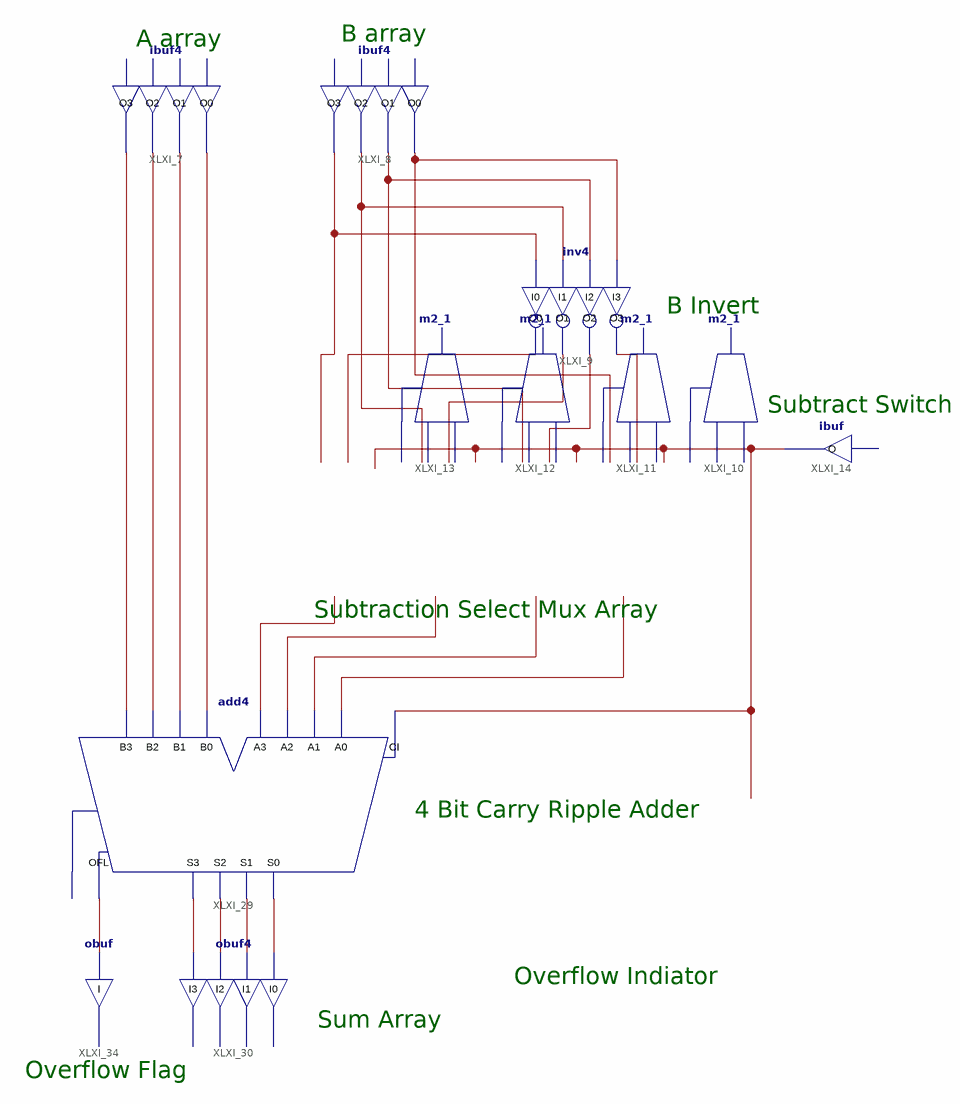
[diagram p0: schematic sheet 1]
// Xilinx ISE schematic Adder_Module_Schematic.sch (spartan3e) as structural Verilog: 11 symbols, 0 ports
module Adder_Module_Schematic (
);

  wire XLXN_8, XLXN_10, XLXN_11, XLXN_14, XLXN_17, XLXN_19, XLXN_20, XLXN_21, XLXN_22, XLXN_23, XLXN_24,
       XLXN_25, XLXN_26, XLXN_29, XLXN_30, XLXN_32, XLXN_34, XLXN_35, XLXN_36, XLXN_37, XLXN_38, XLXN_45;

  ibuf4 XLXI_8 (.O0(XLXN_14), .O1(XLXN_8), .O2(XLXN_10), .O3(XLXN_11));  // open: I0, I1, I2, I3
  inv4 XLXI_9 (
    .I0(XLXN_11), .I1(XLXN_10), .I2(XLXN_8), .I3(XLXN_14), .O0(XLXN_17), .O1(XLXN_19), .O2(XLXN_20),
    .O3(XLXN_21));
  ibuf XLXI_14 (.O(XLXN_26));  // open: I
  m2_1 XLXI_10 (.D0(XLXN_14), .D1(XLXN_21), .S0(XLXN_26), .O(XLXN_25));
  m2_1 XLXI_11 (.D0(XLXN_8), .D1(XLXN_20), .S0(XLXN_26), .O(XLXN_24));
  m2_1 XLXI_12 (.D0(XLXN_10), .D1(XLXN_19), .S0(XLXN_26), .O(XLXN_23));
  m2_1 XLXI_13 (.D0(XLXN_11), .D1(XLXN_17), .O(XLXN_22));  // open: S0
  add4 XLXI_29 (
    .A0(XLXN_25), .A1(XLXN_24), .A2(XLXN_23), .A3(XLXN_22), .B0(XLXN_34), .B1(XLXN_32), .B2(XLXN_29),
    .B3(XLXN_30), .CI(XLXN_26), .OFL(XLXN_45), .S0(XLXN_38), .S1(XLXN_37), .S2(XLXN_36), .S3(XLXN_35));  // open: CO
  obuf4 XLXI_30 (.I0(XLXN_38), .I1(XLXN_37), .I2(XLXN_36), .I3(XLXN_35));  // open: O0, O1, O2, O3
  ibuf4 XLXI_7 (.O0(XLXN_34), .O1(XLXN_32), .O2(XLXN_29), .O3(XLXN_30));  // open: I0, I1, I2, I3
  obuf XLXI_34 (.I(XLXN_45));  // open: O

  // Notes on the sheet:
  //   B array
  //   A array
  //   B Invert
  //   Subtract Switch
  //   Subtraction Select Mux Array
  //   4 Bit Carry Ripple Adder
  //   Overflow Indiator
  //   Sum Array
  //   Overflow Flag
endmodule
